# Altium schematic sheet MCU.SchDoc
size A4; Organization: Technokrat; Address1: 3 Minna Close; Address2: Belrose; Address3: NSW 2085; Address4: Australia; SheetNumber: 7; SheetTotal: 10
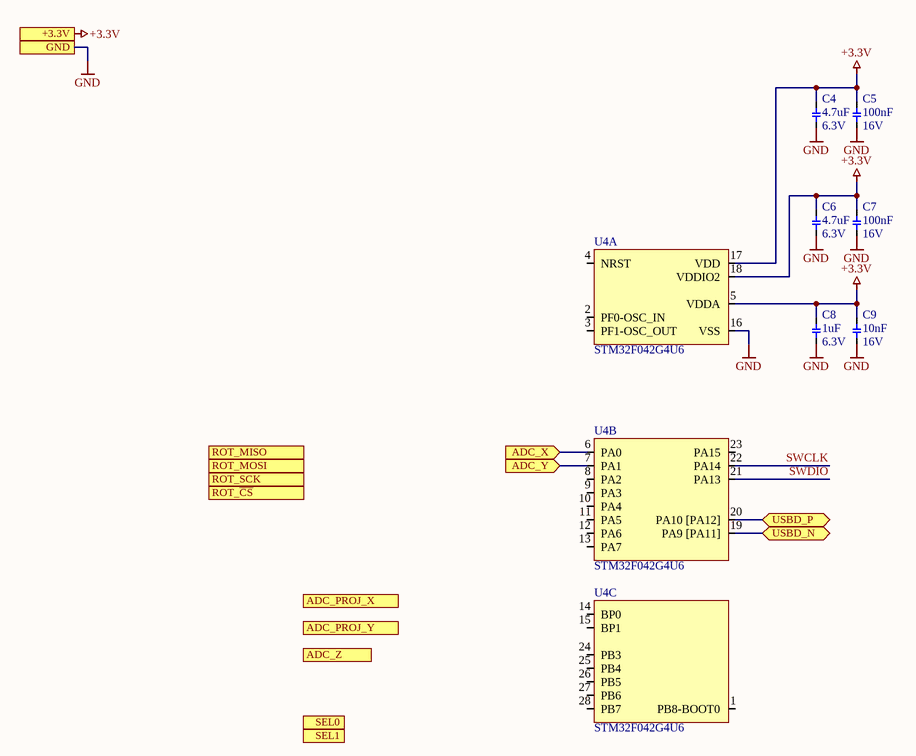
[diagram p0: MCU.SchDoc]

## Parts
C4  value 4.7uF  Value2: 6.3V  [CX7R0603K]  (hidden comment: 06036C475JAT2A)
C5  value 100nF  Value2: 16V  [CX7R0402C]  (hidden comment: 0402YC104JAT2A)
C6  value 4.7uF  Value2: 6.3V  [CX7R0603K]  (hidden comment: 06036C475JAT2A)
C7  value 100nF  Value2: 16V  [CX7R0402C]  (hidden comment: 0402YC104JAT2A)
C8  value 1uF  Value2: 6.3V  [CX7R0603K]  (hidden comment: 06036C105JAT2A)
C9  value 10nF  Value2: 16V  [CX7R0402C]  (hidden comment: 0402YC103JAT2A)
U4  STM32F042G4U6  [UFQFPN28_0.5_C]  (parts A,B,C of 3)

## Ports
+3.3V, ADC_PROJ_X (in), ADC_PROJ_Y (in), ADC_X (in), ADC_Y (in), ADC_Z (in), GND, ROT_MISO (in), ROT_MOSI (out), ROT_SCK (out), ROT_~{CS} (out), SEL0 (out), SEL1 (out), USBD_N (bidir), USBD_P (bidir)

## Nets
+3.3V: C4.2 C5.2 C6.2 C7.2 C8.2 C9.2 U4.5(VDDA) U4.17(VDD) U4.18(VDDIO2) ; port +3.3V
GND: C4.1 C5.1 C6.1 C7.1 C8.1 C9.1 U4.16(VSS) ; port GND
ADC_X: U4.6(PA0) ; port ADC_X
ADC_Y: U4.7(PA1) ; port ADC_Y
SWCLK: U4.22(PA14)
SWDIO: U4.21(PA13)
USBD_N: U4.19(PA9_[PA11]) ; port USBD_N
USBD_P: U4.20(PA10_[PA12]) ; port USBD_P

Not connected (* = marked no-connect by the designer): U4 1(PB8-BOOT0) 2(PF0-OSC_IN) 3(PF1-OSC_OUT) 4(NRST) 8(PA2) 9(PA3) 10(PA4) 11(PA5) 12(PA6) 13(PA7) 14(BP0) 15(BP1) 23(PA15) 24(PB3) 25(PB4) 26(PB5) 27(PB6) 28(PB7)

## Notes on the sheet
- Rev:
- /
- File:

## Library data of the parts
C4 C6 = kyocera-C-X7R-0603: SMD Capacitor; Dielectric: C; ToleranceCode: J; MaxThicknessCode: K; VoltageCode: 6; CapacitanceCode: 475; Size: 0603
C5 C7 = kyocera-C-X7R-0402: SMD Capacitor; CapacitanceCode: 104; VoltageCode: Y; Dielectric: C; ToleranceCode: J; MaxThicknessCode: E; Size: 0402
C8 = kyocera-C-X7R-0603: SMD Capacitor; Dielectric: C; ToleranceCode: J; MaxThicknessCode: K; VoltageCode: 6; CapacitanceCode: 105; Size: 0603
C9 = kyocera-C-X7R-0402: SMD Capacitor; CapacitanceCode: 103; VoltageCode: Y; Dielectric: C; ToleranceCode: J; MaxThicknessCode: E; Size: 0402
U4 = STM32F042G4U6: ARM® Cortex®-M0 series Microcontroller IC 32-Bit 48MHz 16KB (16K x 8) FLASH 28-UFQFPN (4x4); Type: STM32F042G4U6; Supplier 1: Digi-Key; Supplier Part Number 1: 497-17830-ND